# Altium schematic sheet Temp Sensor Board_TOC.SchDoc: Table of Contents
size Tabloid; TOCFontName: Consolas; TOCFontSize: 24; TOCFontColor: 0; TOCFontAttributes: 0; TOCMaxLinesInTable: 25; TOCVerticalOffset: 200; TOCHorizontalOffset: 500; TOCHorizontalSeparation: 800; TOCVerticalSeparation: 30; TOCHorizTableSize: 640; Engineer: JOHN Q. ENGINEER; DocumentNumber: 000-000-000; Revision: A; SheetNumber: 1; SheetTotal: 2; PageSetup: Record=PageOptions|CenterHorizontal=True|CenterVertical=True|PrintScale=0.96|XCorrection=1.00|YCorrection=1.00|PrintKind=0|BorderSize=5000000|LeftOffset=0|BottomOffset=0|Orientation=2|PaperLength=1000|PaperWidth=1000|Scale=100|PaperSource=7|PrintQuality=-4|MediaType=1|DitherType=10|PaperKind=11" x 17"|PrintScaleMode=1
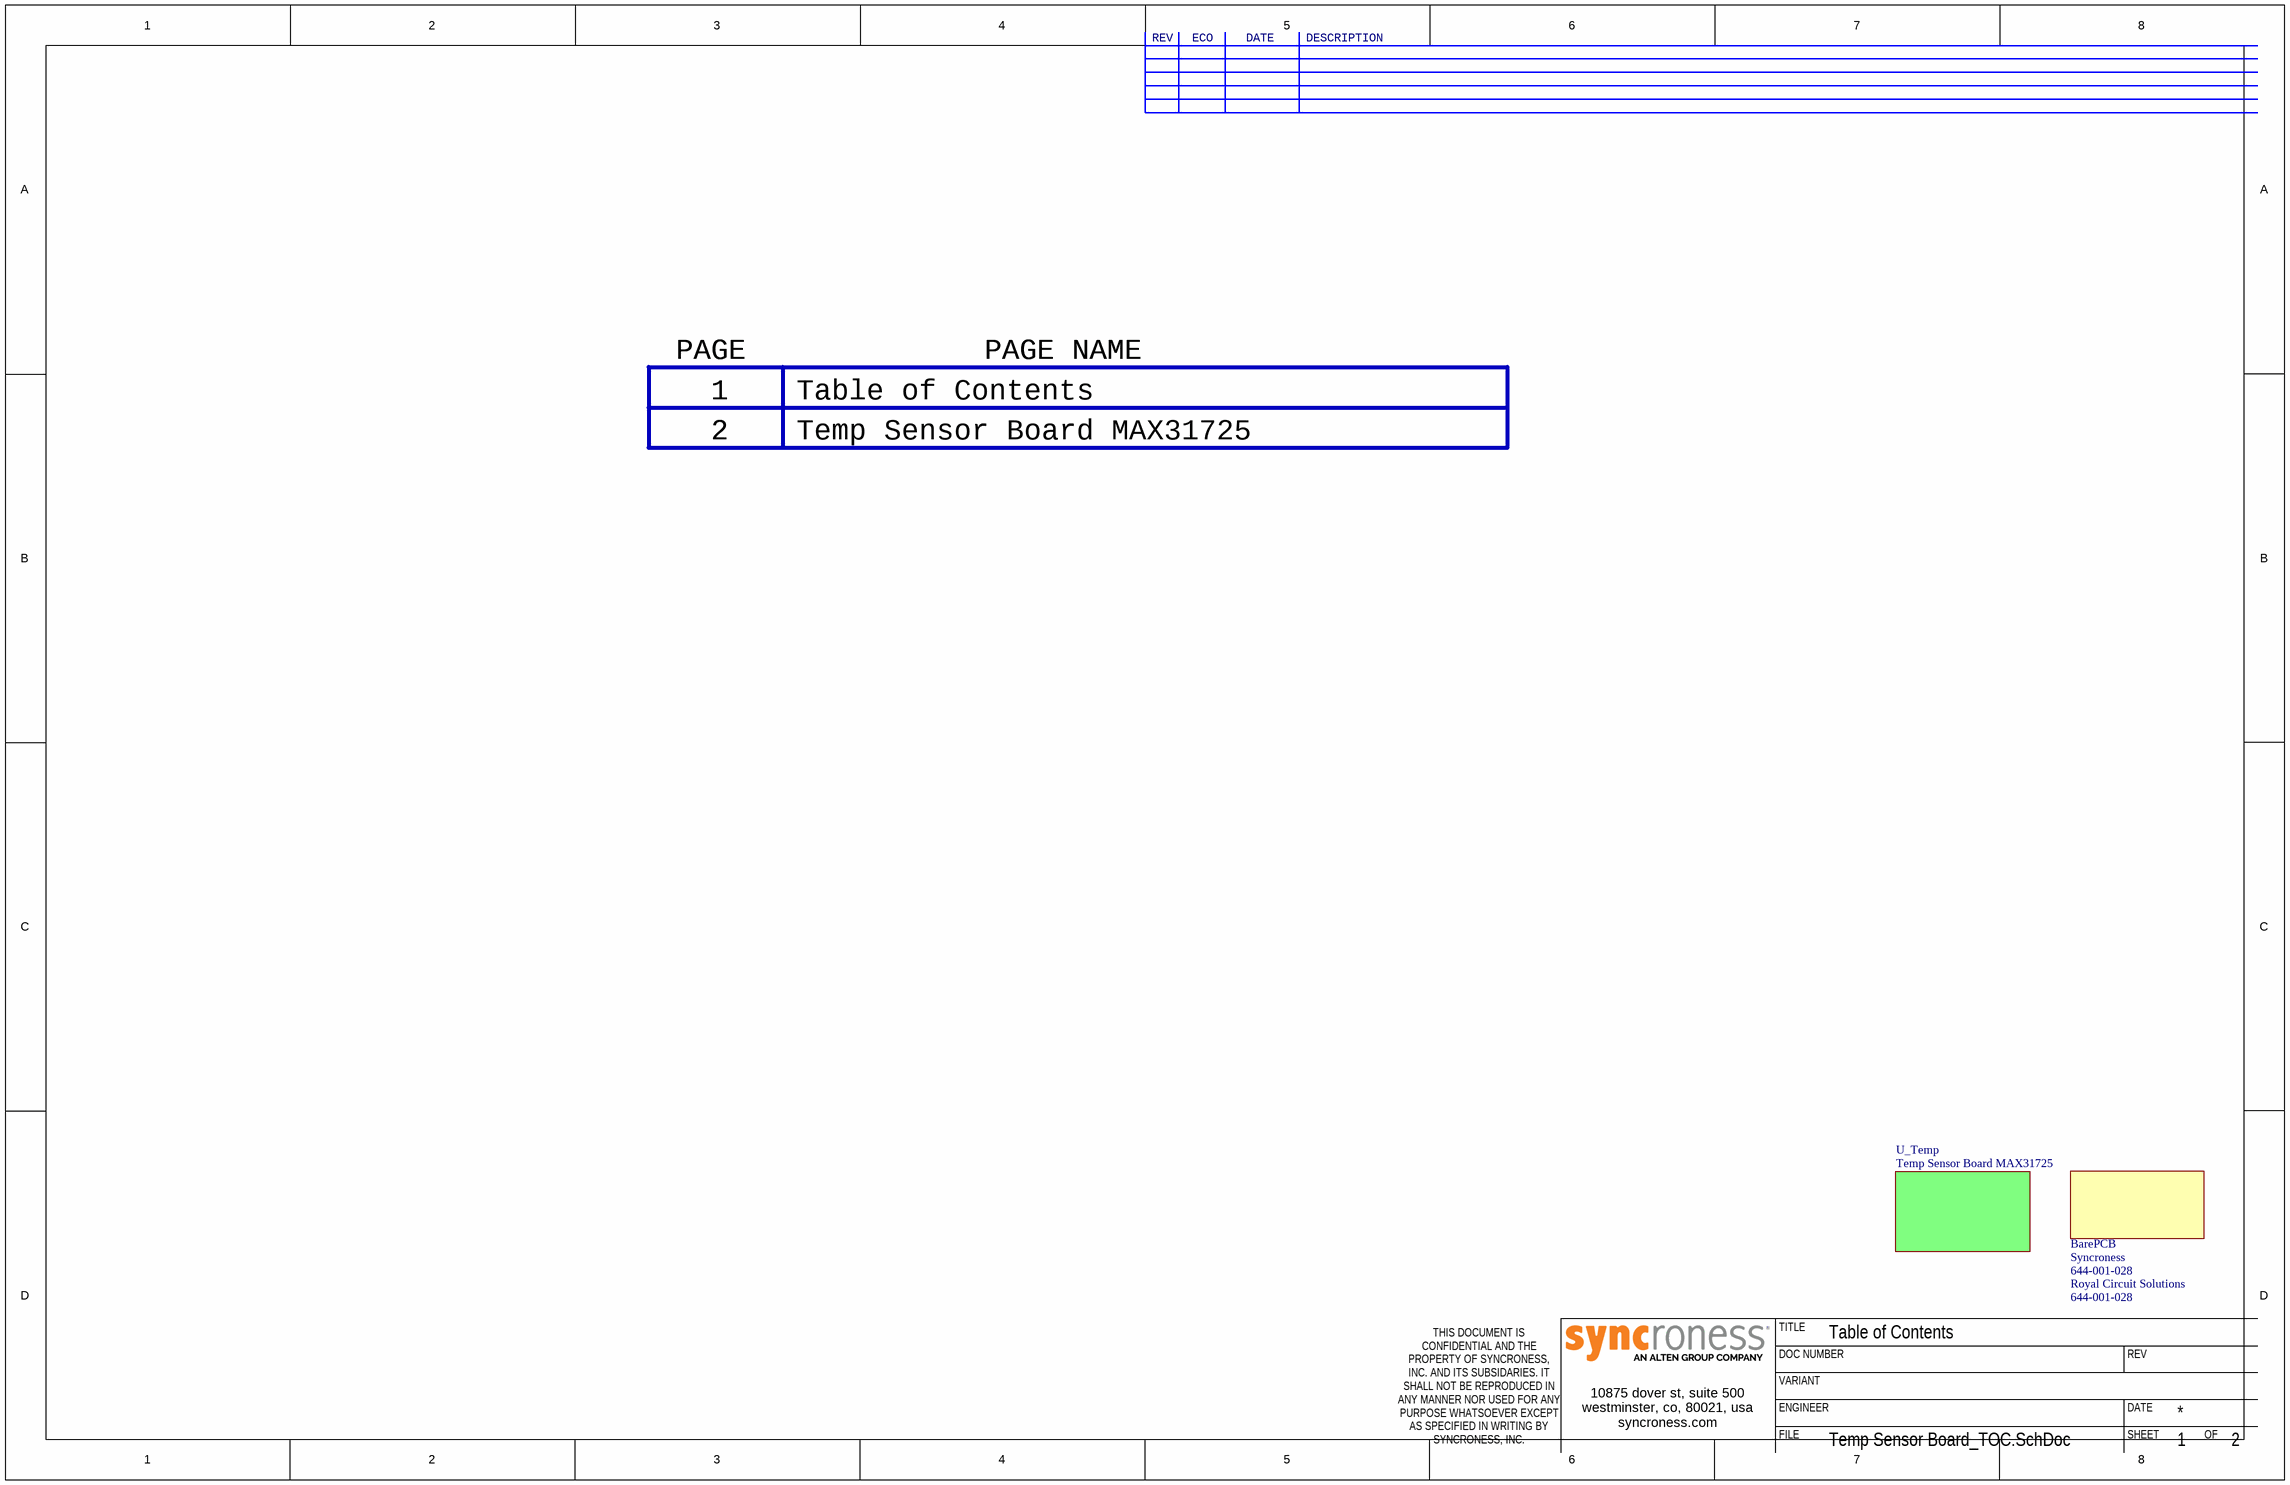
[diagram p0: Temp Sensor Board_TOC.SchDoc]

## Parts
BarePCB  BarePCB  Manufacturer: Syncroness  Manufacturer Part Number: 644-001-028  Supplier 1: Royal Circuit Solutions  (mechanical)

## Sub-sheets
U_Temp = Temp Sensor Board MAX31725: no entries

## Notes on the sheet
- REV
- ECO
- DATE
- DESCRIPTION
- PAGE
- PAGE NAME
- 1
- Table of Contents
- 2
- Temp Sensor Board MAX31725
- TITLE
- DOC NUMBER
- VARIANT
- 10875 dover st, suite 500
  westminster, co, 80021, usa
  syncroness.com
- FILE
- ENGINEER
- SHEET
- OF
- THIS DOCUMENT IS CONFIDENTIAL AND THE PROPERTY OF SYNCRONESS, INC. AND ITS SUBSIDARIES. IT SHALL NOT BE REPRODUCED IN ANY MANNER NOR USED FOR ANY PURPOSE WHATSOEVER EXCEPT AS SPECIFIED IN WRITING BY SYNCRONESS, INC.

## Library data of the parts
BarePCB = CMP-06229-A.6: Component to Add Bare PCB to BOM; Supplier Part Number 1: 644-001-028